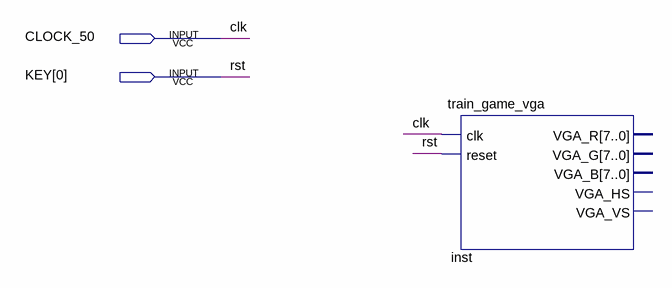
[diagram p0: schematic sheet]
// Quartus schematic projetoTrem.bdf as structural Verilog: 1 symbols, 2 pins
module projetoTrem (
  input  CLOCK_50,
  input  [0:0] KEY
);

  train_game_vga inst (.clk(CLOCK_50), .reset(KEY[0]));  // open: VGA_R, VGA_G, VGA_B, VGA_HS, VGA_VS

  // Other names for the same wires on the sheet: clk = CLOCK_50; rst = KEY[0]
endmodule
